# Altium schematic sheet Thermistors.SchDoc: Thermistors array
size A4; Revision: 1; SheetNumber: 2; SheetTotal: 4
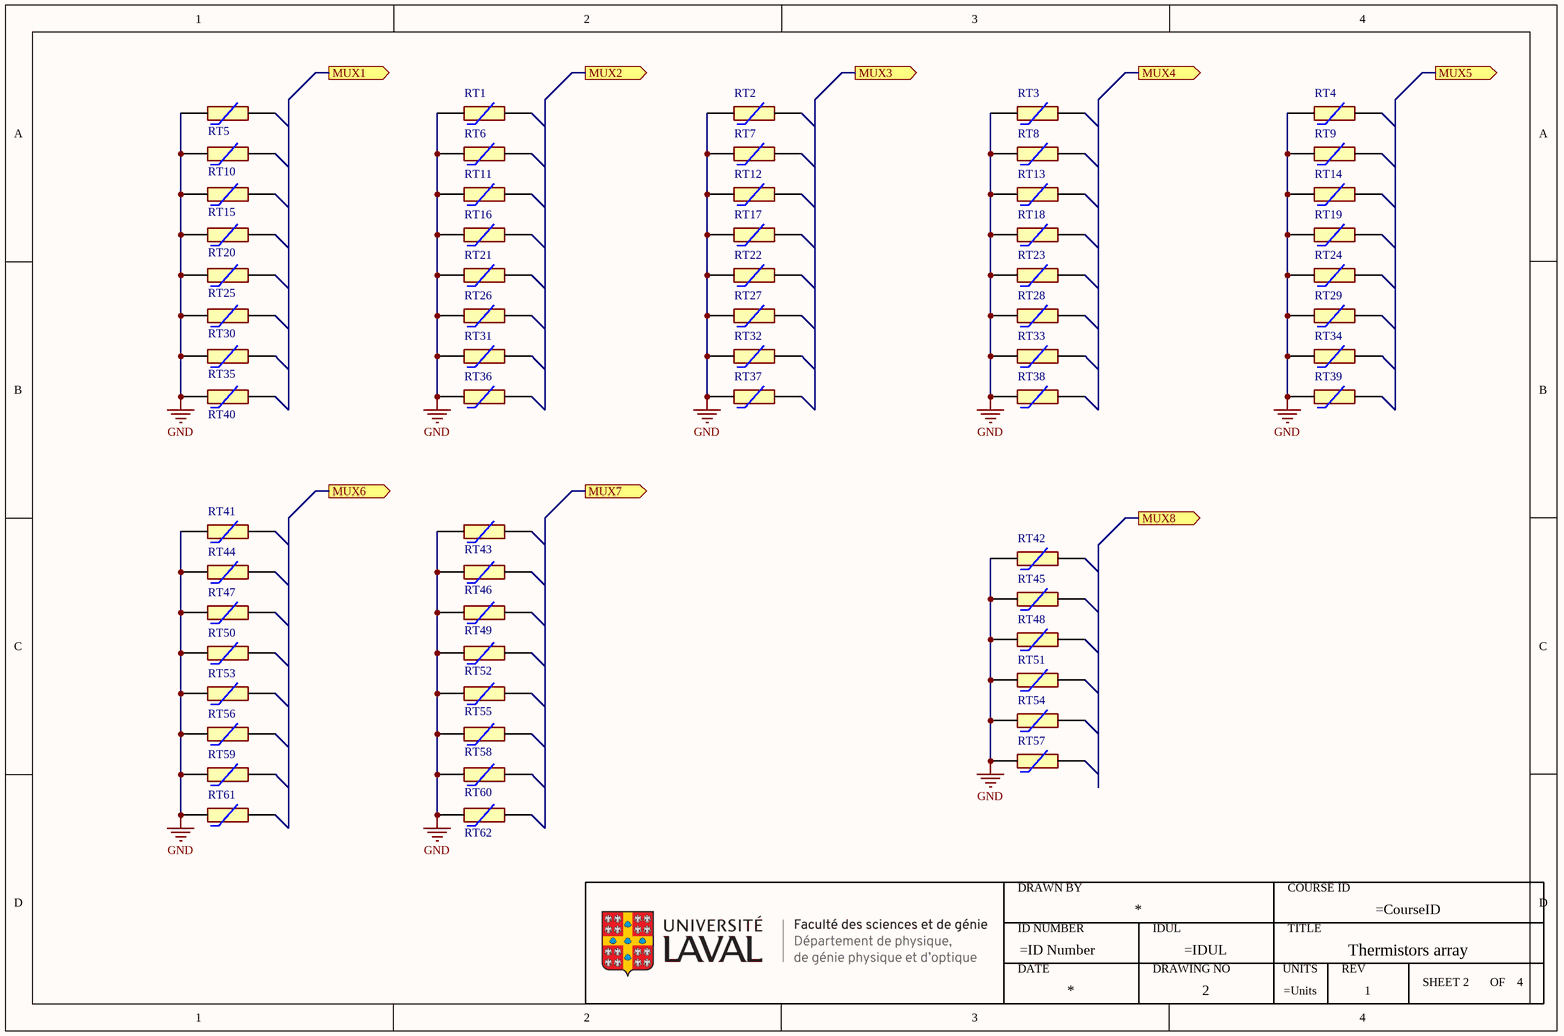
[diagram p0: Thermistors.SchDoc]

## Parts
*2  ULaval FSG-DPGPO  (value not drawn)
RT1  NTCLE350E4103FHB0  [NTCLE350E4103FHB0]  (value not drawn)
RT2  NTCLE350E4103FHB0  [NTCLE350E4103FHB0]  (value not drawn)
RT3  NTCLE350E4103FHB0  [NTCLE350E4103FHB0]  (value not drawn)
RT4  NTCLE350E4103FHB0  [NTCLE350E4103FHB0]  (value not drawn)
RT5  NTCLE350E4103FHB0  [NTCLE350E4103FHB0]  (value not drawn)
RT6  NTCLE350E4103FHB0  [NTCLE350E4103FHB0]  (value not drawn)
RT7  NTCLE350E4103FHB0  [NTCLE350E4103FHB0]  (value not drawn)
RT8  NTCLE350E4103FHB0  [NTCLE350E4103FHB0]  (value not drawn)
RT9  NTCLE350E4103FHB0  [NTCLE350E4103FHB0]  (value not drawn)
RT10  NTCLE350E4103FHB0  [NTCLE350E4103FHB0]  (value not drawn)
RT11  NTCLE350E4103FHB0  [NTCLE350E4103FHB0]  (value not drawn)
RT12  NTCLE350E4103FHB0  [NTCLE350E4103FHB0]  (value not drawn)
RT13  NTCLE350E4103FHB0  [NTCLE350E4103FHB0]  (value not drawn)
RT14  NTCLE350E4103FHB0  [NTCLE350E4103FHB0]  (value not drawn)
RT15  NTCLE350E4103FHB0  [NTCLE350E4103FHB0]  (value not drawn)
RT16  NTCLE350E4103FHB0  [NTCLE350E4103FHB0]  (value not drawn)
RT17  NTCLE350E4103FHB0  [NTCLE350E4103FHB0]  (value not drawn)
RT18  NTCLE350E4103FHB0  [NTCLE350E4103FHB0]  (value not drawn)
RT19  NTCLE350E4103FHB0  [NTCLE350E4103FHB0]  (value not drawn)
RT20  NTCLE350E4103FHB0  [NTCLE350E4103FHB0]  (value not drawn)
RT21  NTCLE350E4103FHB0  [NTCLE350E4103FHB0]  (value not drawn)
RT22  NTCLE350E4103FHB0  [NTCLE350E4103FHB0]  (value not drawn)
RT23  NTCLE350E4103FHB0  [NTCLE350E4103FHB0]  (value not drawn)
RT24  NTCLE350E4103FHB0  [NTCLE350E4103FHB0]  (value not drawn)
RT25  NTCLE350E4103FHB0  [NTCLE350E4103FHB0]  (value not drawn)
RT26  NTCLE350E4103FHB0  [NTCLE350E4103FHB0]  (value not drawn)
RT27  NTCLE350E4103FHB0  [NTCLE350E4103FHB0]  (value not drawn)
RT28  NTCLE350E4103FHB0  [NTCLE350E4103FHB0]  (value not drawn)
RT29  NTCLE350E4103FHB0  [NTCLE350E4103FHB0]  (value not drawn)
RT30  NTCLE350E4103FHB0  [NTCLE350E4103FHB0]  (value not drawn)
RT31  NTCLE350E4103FHB0  [NTCLE350E4103FHB0]  (value not drawn)
RT32  NTCLE350E4103FHB0  [NTCLE350E4103FHB0]  (value not drawn)
RT33  NTCLE350E4103FHB0  [NTCLE350E4103FHB0]  (value not drawn)
RT34  NTCLE350E4103FHB0  [NTCLE350E4103FHB0]  (value not drawn)
RT35  NTCLE350E4103FHB0  [NTCLE350E4103FHB0]  (value not drawn)
RT36  NTCLE350E4103FHB0  [NTCLE350E4103FHB0]  (value not drawn)
RT37  NTCLE350E4103FHB0  [NTCLE350E4103FHB0]  (value not drawn)
RT38  NTCLE350E4103FHB0  [NTCLE350E4103FHB0]  (value not drawn)
RT39  NTCLE350E4103FHB0  [NTCLE350E4103FHB0]  (value not drawn)
RT40  NTCLE350E4103FHB0  [NTCLE350E4103FHB0]  (value not drawn)
RT41  NTCLE350E4103FHB0  [NTCLE350E4103FHB0]  (value not drawn)
RT42  NTCLE350E4103FHB0  [NTCLE350E4103FHB0]  (value not drawn)
RT43  NTCLE350E4103FHB0  [NTCLE350E4103FHB0]  (value not drawn)
RT44  NTCLE350E4103FHB0  [NTCLE350E4103FHB0]  (value not drawn)
RT45  NTCLE350E4103FHB0  [NTCLE350E4103FHB0]  (value not drawn)
RT46  NTCLE350E4103FHB0  [NTCLE350E4103FHB0]  (value not drawn)
RT47  NTCLE350E4103FHB0  [NTCLE350E4103FHB0]  (value not drawn)
RT48  NTCLE350E4103FHB0  [NTCLE350E4103FHB0]  (value not drawn)
RT49  NTCLE350E4103FHB0  [NTCLE350E4103FHB0]  (value not drawn)
RT50  NTCLE350E4103FHB0  [NTCLE350E4103FHB0]  (value not drawn)
RT51  NTCLE350E4103FHB0  [NTCLE350E4103FHB0]  (value not drawn)
RT52  NTCLE350E4103FHB0  [NTCLE350E4103FHB0]  (value not drawn)
RT53  NTCLE350E4103FHB0  [NTCLE350E4103FHB0]  (value not drawn)
RT54  NTCLE350E4103FHB0  [NTCLE350E4103FHB0]  (value not drawn)
RT55  NTCLE350E4103FHB0  [NTCLE350E4103FHB0]  (value not drawn)
RT56  NTCLE350E4103FHB0  [NTCLE350E4103FHB0]  (value not drawn)
RT57  NTCLE350E4103FHB0  [NTCLE350E4103FHB0]  (value not drawn)
RT58  NTCLE350E4103FHB0  [NTCLE350E4103FHB0]  (value not drawn)
RT59  NTCLE350E4103FHB0  [NTCLE350E4103FHB0]  (value not drawn)
RT60  NTCLE350E4103FHB0  [NTCLE350E4103FHB0]  (value not drawn)
RT61  NTCLE350E4103FHB0  [NTCLE350E4103FHB0]  (value not drawn)
RT62  NTCLE350E4103FHB0  [NTCLE350E4103FHB0]  (value not drawn)

## Ports
MUX1 (out), MUX2 (out), MUX3 (out), MUX4 (out), MUX5 (out), MUX6 (out), MUX7 (out), MUX8 (out)

## Nets
GND: RT1.1 RT2.1 RT3.1 RT4.1 RT5.1 RT6.1 RT7.1 RT8.1 RT9.1 RT10.1 RT11.1 RT12.1 RT13.1 RT14.1 RT15.1 RT16.1 RT17.1 RT18.1 RT19.1 RT20.1 RT21.1 RT22.1 RT23.1 RT24.1 RT25.1 RT26.1 RT27.1 RT28.1 RT29.1 RT30.1 RT31.1 RT32.1 RT33.1 RT34.1 RT35.1 RT36.1 RT37.1 RT38.1 RT39.1 RT40.1 RT41.1 RT42.1 RT43.1 RT44.1 RT45.1 RT46.1 RT47.1 RT48.1 RT49.1 RT50.1 RT51.1 RT52.1 RT53.1 RT54.1 RT55.1 RT56.1 RT57.1 RT58.1 RT59.1 RT60.1 RT61.1 RT62.1

Not connected (* = marked no-connect by the designer): RT1 2; RT2 2; RT3 2; RT4 2; RT5 2; RT6 2; RT7 2; RT8 2; RT9 2; RT10 2; RT11 2; RT12 2; RT13 2; RT14 2; RT15 2; RT16 2; RT17 2; RT18 2; RT19 2; RT20 2; RT21 2; RT22 2; RT23 2; RT24 2; RT25 2; RT26 2; RT27 2; RT28 2; RT29 2; RT30 2; RT31 2; RT32 2; RT33 2; RT34 2; RT35 2; RT36 2; RT37 2; RT38 2; RT39 2; RT40 2; RT41 2; RT42 2; RT43 2; RT44 2; RT45 2; RT46 2; RT47 2; RT48 2; RT49 2; RT50 2; RT51 2; RT52 2; RT53 2; RT54 2; RT55 2; RT56 2; RT57 2; RT58 2; RT59 2; RT60 2; RT61 2; RT62 2

## Notes on the sheet
- (in symbol ULaval FSG-DPGPO) DRAWN BY; COURSE ID; ID NUMBER; IDUL; TITLE; DATE; DRAWING NO; UNITS; REV; SHEET; OF

## Library data of the parts
RT1-RT62 = NTCLE350E4103FHB0: Thermistor; Manufacturer_Name: Vishay; Datasheet Link: https://www.vishay.com/docs/29218/ntcle350e4.pdf; Height: 7mm; Manufacturer_Part_Number: NTCLE350E4103FHB0